# EAGLE schematic Simple NPN Regen Receiver (EAGLE 7.2.0)
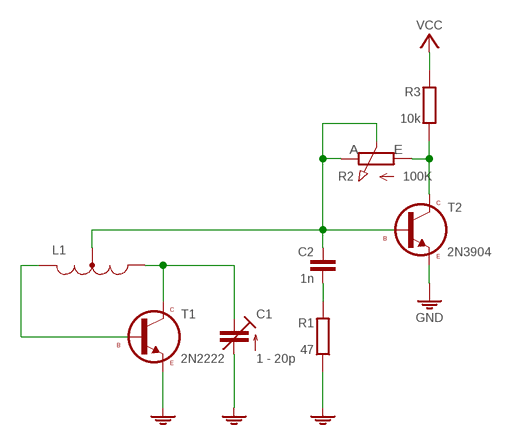
[diagram p0: schematic, sheet 1]

## Parts
C1  1 - 20p  C-TR-PH201272222-808-2PINB  [TRIM-2222-808]
C2  1n  C025-024X044  [C025-024X044]
L1  L-H-TAPM-08/20V  [L-08/20V-TAPM]
R1  47  R0204/10-V  [0204/10-V]
R2  100K  POT-H  [POT]
R3  10k  R0202/10-V  [0202/10-V]
S3  VCC_GNDR  [SPAD+-]
T1  2N2222  [TO92]
T2  2N3904  2N3904-A  [TO92-EBC-A]

## Nets
GND: C1.3(A) R1.2 S3.1 T1.3(E) T2.E
N$1: C2.2 R1.1
N$2: L1.1 T1.2(B)
N$3: C2.1 L1.T R2.E R2.S T2.B
N$4: C1.2(E) L1.2 T1.1(C)
N$5: R2.A R3.2 T2.C
VCC: R3.1 S3.2

## Library data of the parts
C1 = cap-trim:C-TR-PH20127
C2 = c:C: CAPACITOR, European symbol
L1 = l:L-H-TAPM
R1 R3 = r:R: RESISTOR, European symbol
R2 = r:POT-H
S3 = pad:VCC_GND
T1 = t:2N2222
T2 = t:2N3904